# Altium schematic sheet MCU_1.12.SchDoc
size A4
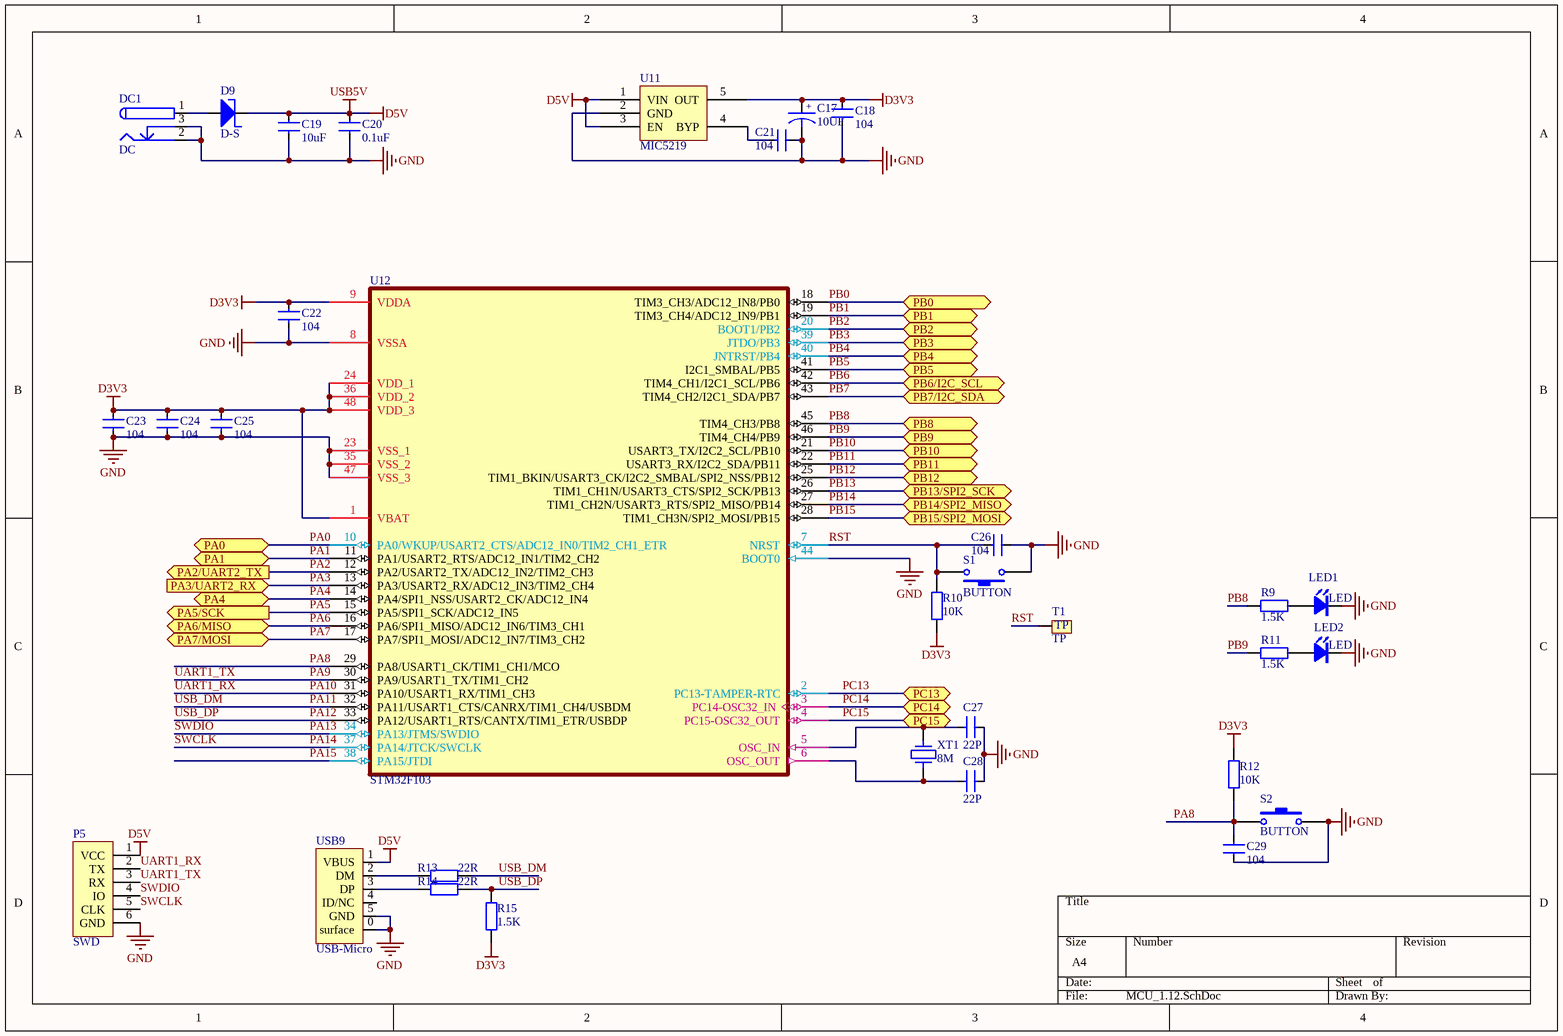
[diagram p0: MCU_1.12.SchDoc]

## Parts
C17  10UF  [3216C]
C18  104  [0603C]
C19  10uF  [0805C]
C20  0.1uF  [0402C]
C21  104  [0603C]
C22  104  [0603C]
C23  104  [0603C]
C24  104  [0603C]
C25  104  [0603C]
C26  104  [0603C]
C27  22P  [0603C]
C28  22P  [0603C]
C29  104  [0603C]
D9  D-S  [SOD123]
DC1  DC  [DC005]
LED1  LED  [0805D]
LED2  LED  [0805D]
P5  SWD  [HDR1X6]
R9  1.5K  [0603R]
R10  10K  [0603R]
R11  1.5K  [0603R]
R12  10K  [0603R]
R13  22R  [0603R]
R14  22R  [0603R]
R15  1.5K  [0603R]
S1  BUTTON  [SW-3X4X2]
S2  BUTTON  [SW-3X4X2]
T1  TP  [TP1]
U11  MIC5219  [SOT23-5]
U12  STM32F103  [LQFP48]
USB9  USB-Micro  [USB-Micro-2]
XT1  8M  [5032]

## Ports
PA0, PA1, PA2/UART2_TX (out), PA3/UART2_RX (in), PA4, PA5/SCK (out), PA6/MISO, PA7/MOSI, PB0, PB1, PB2, PB3, PB4, PB5, PB6/I2C_SCL, PB7/I2C_SDA, PB8, PB9, PB10, PB11, PB12, PB13/SPI2_SCK, PB14/SPI2_MISO, PB15/SPI2_MOSI, PC13, PC14, PC15

## Nets
D3V3: C17.1 C18.2 C22.2 C23.2 C24.1 C25.2 R10.1 R12.1 R15.2 U11.5(OUT) U12.1(VBAT) U12.9(VDDA) U12.24(VDD_1) U12.36(VDD_2) U12.48(VDD_3)
D5V: C19.1 C20.1 D9.K P5.1(VCC) U11.1(VIN) U11.3(EN) USB9.1(VBUS)  [also labelled USB5V]
GND: C17.2 C18.1 C19.2 C20.2 C21.2 C22.1 C23.1 C24.2 C25.1 C26.2 C27.2 C28.2 C29.1 DC1.2 DC1.3 LED1.K LED2.K P5.6(GND) S1.1 S2.2 U11.2(GND) U12.8(VSSA) U12.23(VSS_1) U12.35(VSS_2) U12.44(BOOT0) U12.47(VSS_3) USB9.0(surface) USB9.5(GND)
PA0: U12.10(PA0/WKUP/USART2_CTS/ADC12_IN0/TIM2_CH1_ETR) ; port PA0
PA1: U12.11(PA1/USART2_RTS/ADC12_IN1/TIM2_CH2) ; port PA1
PA2: U12.12(PA2/USART2_TX/ADC12_IN2/TIM2_CH3) ; port PA2/UART2_TX
PA3: U12.13(PA3/USART2_RX/ADC12_IN3/TIM2_CH4) ; port PA3/UART2_RX
PA4: U12.14(PA4/SPI1_NSS/USART2_CK/ADC12_IN4) ; port PA4
PA5: U12.15(PA5/SPI1_SCK/ADC12_IN5) ; port PA5/SCK
PA6: U12.16(PA6/SPI1_MISO/ADC12_IN6/TIM3_CH1) ; port PA6/MISO
PA7: U12.17(PA7/SPI1_MOSI/ADC12_IN7/TIM3_CH2) ; port PA7/MOSI
PA8: C29.2 R12.2 S2.1 U12.29(PA8/USART1_CK/TIM1_CH1/MCO)
PA9: P5.3(RX) U12.30(PA9/USART1_TX/TIM1_CH2)  [also labelled UART1_TX]
PA10: P5.2(TX) U12.31(PA10/USART1_RX/TIM1_CH3)  [also labelled UART1_RX]
PA11: R13.1 U12.32(PA11/USART1_CTS/CANRX/TIM1_CH4/USBDM)  [also labelled USB_DM]
PA12: R14.1 R15.1 U12.33(PA12/USART1_RTS/CANTX/TIM1_ETR/USBDP)  [also labelled USB_DP]
PA13: P5.4(IO) U12.34(PA13/JTMS/SWDIO)  [also labelled SWDIO]
PA14: P5.5(CLK) U12.37(PA14/JTCK/SWCLK)  [also labelled SWCLK]
PA15: U12.38(PA15/JTDI)
PB0: U12.18(TIM3_CH3/ADC12_IN8/PB0) ; port PB0
PB1: U12.19(TIM3_CH4/ADC12_IN9/PB1) ; port PB1
PB2: U12.20(BOOT1/PB2) ; port PB2
PB3: U12.39(JTDO/PB3) ; port PB3
PB4: U12.40(JNTRST/PB4) ; port PB4
PB5: U12.41(I2C1_SMBAL/PB5) ; port PB5
PB6: U12.42(TIM4_CH1/I2C1_SCL/PB6) ; port PB6/I2C_SCL
PB7: U12.43(TIM4_CH2/I2C1_SDA/PB7) ; port PB7/I2C_SDA
PB8: R9.1 U12.45(TIM4_CH3/PB8) ; port PB8
PB9: R11.1 U12.46(TIM4_CH4/PB9) ; port PB9
PB10: U12.21(USART3_TX/I2C2_SCL/PB10) ; port PB10
PB11: U12.22(USART3_RX/I2C2_SDA/PB11) ; port PB11
PB12: U12.25(TIM1_BKIN/USART3_CK/I2C2_SMBAL/SPI2_NSS/PB12) ; port PB12
PB13: U12.26(TIM1_CH1N/USART3_CTS/SPI2_SCK/PB13) ; port PB13/SPI2_SCK
PB14: U12.27(TIM1_CH2N/USART3_RTS/SPI2_MISO/PB14) ; port PB14/SPI2_MISO
PB15: U12.28(TIM1_CH3N/SPI2_MOSI/PB15) ; port PB15/SPI2_MOSI
PC13: U12.2(PC13-TAMPER-RTC) ; port PC13
PC14: U12.3(PC14-OSC32_IN) ; port PC14
PC15: U12.4(PC15-OSC32_OUT) ; port PC15
RST: C26.1 R10.2 S1.2 T1.1 U12.7(NRST)
NetC21_1: C21.1 U11.4(BYP)
NetC27_1: C27.1 U12.5(OSC_IN) XT1.1
NetC28_1: C28.1 U12.6(OSC_OUT) XT1.2
NetD9_A: D9.A DC1.1
NetLED1_A: LED1.A R9.2
NetLED2_A: LED2.A R11.2
NetR13_2: R13.2 USB9.2(DM)
NetR14_2: R14.2 USB9.3(DP)

Not connected (* = marked no-connect by the designer): USB9 4(ID/NC)

## Notes on the sheet
- Labels drawn without touching a wire or pin: ENC1, ENC2, ENC3
- (in symbol CAP-T) +

## Library data of the parts
C17 = CAP-T: 钽电容
C18 C21-C29 = CAP: 普通小电容
C19 C20 = CAP: 普通小电容; 电压: 50V
D9 = D-S: 肖特基二极管
DC1 = DC00X: 圆形电源接口
P5 = SWD: 单片机端
R9-R15 = RES: 普通电阻
T1 = TP: testpoint
USB9 = USB-Micro: USB 1.1, Right Angle, SMT, A Type, Plug, 4 Position, Natural; ContactMaterial: Brass; ContactPlating: Gold (30) over Nickel (50); PCB_Layout: Complies with manufacturer's recommendation.; DrillSize: Corresponds to nominal value.; PanelGround: Without; Published: 15-Jul-2004; DatasheetDocument: 21-Jan-2003; PackageDocument: 21-Jan-2003; PackageReference: 1470695A; Publisher: Altium Limited; HousingMaterial: Thermoplastic; ComponentLink1Description: Manufacturer Link; ComponentLink1URL: http://www.tycoelectronics.com/; ComponentLink2Description: Packaging Specification; ComponentLink2URL: http://ecommas.tycoelectronics.com/commerce/DocumentDelivery/DDEController?Action=showdoc&DocId=Customer+Drawing%7F1470695%7FO%7Fpdf%7FEnglish%7FC_1470695_O.pdf
XT1 = XT: 晶振